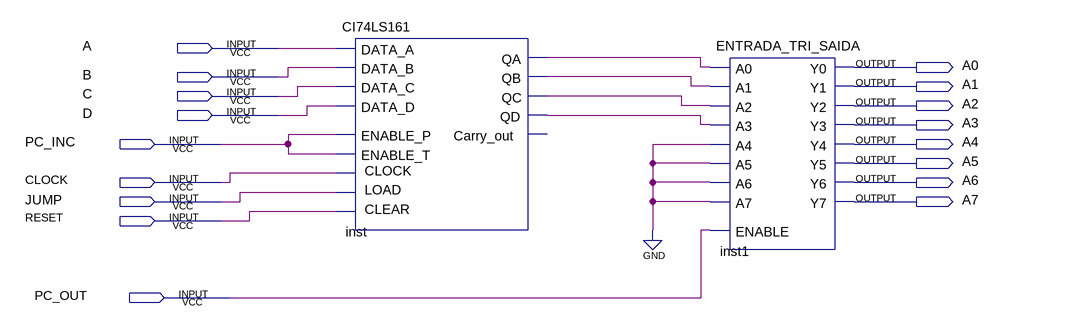
[diagram p0: schematic sheet]
// Quartus schematic CONTADOR_DE_PROGRAMA.bdf as structural Verilog: 2 symbols, 17 pins
module CONTADOR_DE_PROGRAMA (
  input  A,
  input  B,
  input  C,
  input  D,
  input  PC_INC,
  input  CLOCK,
  input  JUMP,
  input  RESET,
  input  PC_OUT,
  output A0,
  output A1,
  output A2,
  output A3,
  output A4,
  output A5,
  output A6,
  output A7
);

  wire inst_qa, inst_qb, inst_qc, inst_qd;

  CI74LS161 inst (
    .CLOCK(CLOCK), .DATA_A(A), .CLEAR(RESET), .DATA_B(B), .LOAD(JUMP), .ENABLE_P(PC_INC), .ENABLE_T(PC_INC),
    .DATA_C(C), .DATA_D(D), .QA(inst_qa), .QB(inst_qb), .QC(inst_qc), .QD(inst_qd));  // open: Carry_out
  ENTRADA_TRI_SAIDA inst1 (
    .ENABLE(PC_OUT), .A7(1'b0), .A6(1'b0), .A5(1'b0), .A4(1'b0), .A3(inst_qd), .A2(inst_qc), .A1(inst_qb),
    .A0(inst_qa), .Y7(A7), .Y6(A6), .Y5(A5), .Y4(A4), .Y3(A3), .Y2(A2), .Y1(A1), .Y0(A0));
endmodule
